# Altium schematic sheet Channel.SchDoc
size A3; SheetNumber: 2; SheetTotal: 4
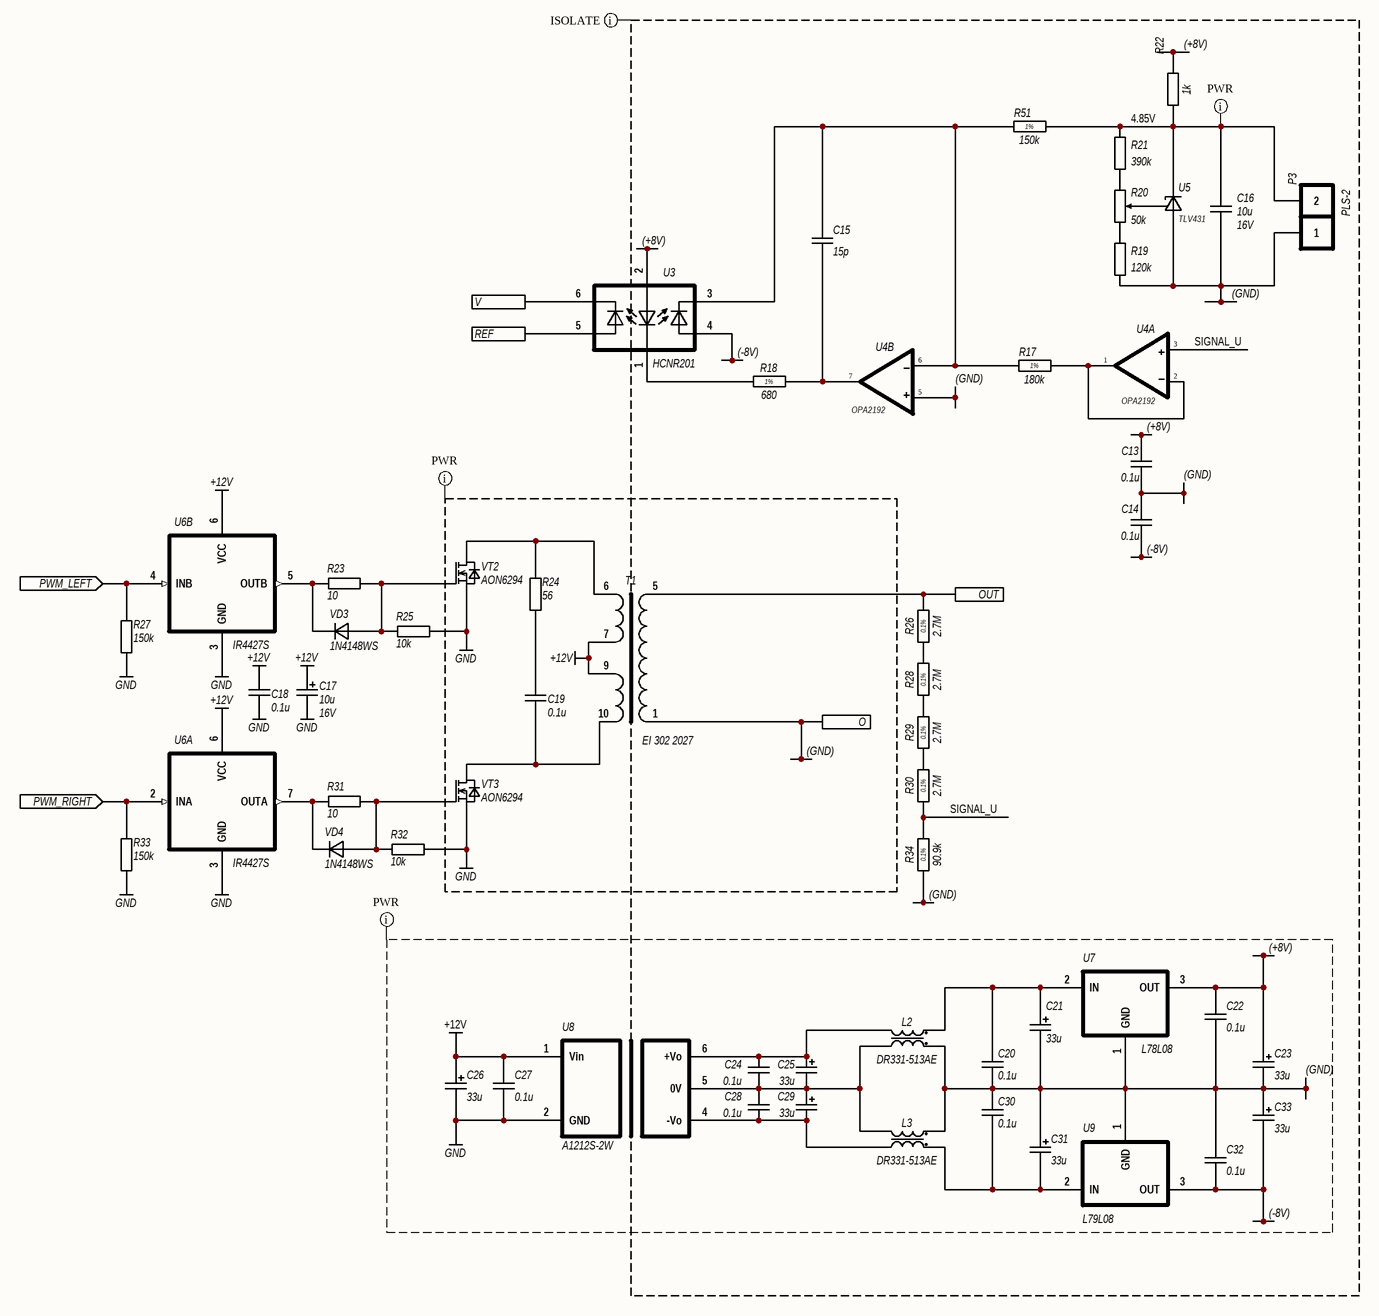
[diagram p0: Channel.SchDoc]

## Parts
C13  0.1u  [C0603(1608)]
C14  0.1u  [C0603(1608)]
C15  15p  [C0603(1608)]
C16  10u  Voltage: 16V  [C0603(1608)]
C17  10u  Voltage: 16V  [EL Case A (3216-18)]
C18  0.1u  [C0603(1608)]
C19  0.1u  [C1206(3216)]
C20  0.1u  [C0603(1608)]
C21  33u  [EL Case A (3216-18)]
C22  0.1u  [C0603(1608)]
C23  33u  [EL Case A (3216-18)]
C24  0.1u  [C0603(1608)]
C25  33u  [EL Case A (3216-18)]
C26  33u  [EL Case A (3216-18)]
C27  0.1u  [C0603(1608)]
C28  0.1u  [C0603(1608)]
C29  33u  [EL Case A (3216-18)]
C30  0.1u  [C0603(1608)]
C31  33u  [EL Case A (3216-18)]
C32  0.1u  [C0603(1608)]
C33  33u  [EL Case A (3216-18)]
L2  DR331-513AE  [DR331]
L3  DR331-513AE  [DR331]
P3  PLS-2  [PLS-2]
R17  180k  Accuracy: 1%  [R0603]
R18  680  Accuracy: 1%  [R1206]
R19  120k  [R0603]
R20  50k  [T910W (3296W)]
R21  390k  [R0603]
R22  1k  [R0603]
R23  10  [R0603]
R24  56  [R2512]
R25  10k  [R0603]
R26  2.7M  Accuracy: 0.1%  [R2512]
R27  150k  [R0603]
R28  2.7M  Accuracy: 0.1%  [R2512]
R29  2.7M  Accuracy: 0.1%  [R2512]
R30  2.7M  Accuracy: 0.1%  [R2512]
R31  10  [R0603]
R32  10k  [R0603]
R33  150k  [R0603]
R34  90.9k  Accuracy: 0.1%  [R2512]
R51  150k  Accuracy: 1%  [R0603]
T1  EI 302 2027  [EI 302 2027]
U3  HCNR201  [HCNR201]
U4  OPA2192  [SO8-150]  (parts A,B of 2)
U5  TLV431  [SOT23]
U6  IR4427S  [SO8-150]  (parts A,B of 2)
U7  L78L08  [SO8-150]
U8  A1212S-2W  [AxxyyS-2W]
U9  L79L08  [SO8-150]
VD3  1N4148WS  [SOD323]
VD4  1N4148WS  [SOD323]
VT2  AON6294  [DFN5x6]
VT3  AON6294  [DFN5x6]

## Ports
O (see Main[8A]), OUT (see Main[8A]), PWM_LEFT (in, see Main[7A]), PWM_RIGHT (in, see Main[7A]), REF (see Main[7A]), V (see Main[7A])

## Nets
+12V: C17.1 C18.1 C26.1 C27.2 T1.7 T1.9 U6.6(VCC) U8.1(Vin)
GND: C17.2 C18.2 C26.2 C27.1 R25.1 R27.2 R32.1 R33.2 U6.3(GND) U8.2(GND) VT2.3(S) VT3.3(S)
V+: U4.8(V+)
V-: U4.4(V-)
(+8V): C13.2 C22.2 C23.1 R22.1 U3.2(LED_ANODE) U7.3(OUT)
(-8V): C14.1 C32.1 C33.2 U3.4(PD1_ANODE) U9.3(OUT)
(GND): C13.1 C14.2 C16.1 C20.1 C21.2 C22.1 C23.2 C30.2 C31.1 C32.2 C33.1 L2.1 L3.2 P3.1 R19.2 R34.1 T1.1 U4.5(+IN) U5.3(A) U7.1(GND) U9.1(GND) ; port O
OUT: R26.2 T1.5 ; port OUT
PWM_LEFT: R27.1 U6.4(INB) ; port PWM_LEFT
PWM_RIGHT: R33.1 U6.2(INA) ; port PWM_RIGHT
REF: U3.5(PD2_ANODE) ; port REF
SIGNAL_U: R30.1 R34.2 U4.3(+IN)
V: U3.6(PD2_CATHODE) ; port V
NetC15_1: C15.1 R18.1 U4.7(OUT)
NetC15_2: C15.2 R17.2 R51.2 U3.3(PD1_CATHODE) U4.6(-IN)
NetC16_2: C16.2 P3.2 R21.1 R22.2 R51.1 U5.2(K)
NetC19_1: C19.1 R24.1
NetC19_2: C19.2 T1.10 VT3.2(D)
NetC20_2: C20.2 C21.1 L2.2 U7.2(IN)
NetC24_1: C24.1 C25.2 C28.2 C29.1 L2.4 L3.3 U8.5(0V)
NetC24_2: C24.2 C25.1 L2.3 U8.6(+Vo)
NetC28_1: C28.1 C29.2 L3.4 U8.4(-Vo)
NetC30_1: C30.1 C31.2 L3.1 U9.2(IN)
NetR17_1: R17.1 U4.1(OUT) U4.2(-IN)
NetR18_2: R18.2 U3.1(LED_CATHODE)
NetR19_1: R19.1 R20.1
NetR20_2: R20.2 U5.1(Adj)
NetR20_3: R20.3 R21.2
NetR23_1: R23.1 U6.5(OUTB) VD3.2(K)
NetR23_2: R23.2 R25.2 VD3.1(A) VT2.1(G)
NetR24_2: R24.2 T1.6 VT2.2(D)
NetR26_1: R26.1 R28.2
NetR28_1: R28.1 R29.2
NetR29_1: R29.1 R30.2
NetR31_1: R31.1 U6.7(OUTA) VD4.2(K)
NetR31_2: R31.2 R32.2 VD4.1(A) VT3.1(G)

## Layout directives
net class PWR: (+8V), (-8V), (GND), +12V, GND, NetC16_2
mark named ISOLATE: (+8V), (-8V), (GND), SIGNAL_U

## Notes on the sheet
- 4.85V
- Автор
- Дата

## Library data of the parts
C13-C16 C20 C22 C24 C27 C28 C30 C32 = Capasitor SMD: Model: *
  C13 C14 C20 C22 C24 C27 C28 C30 C32: Value: 0.1u
  C15: Value: 15p
  C16: Value: 10u
C17 = Capasitor TECAP: 10uF 16V Tantalum capasitor in Case-A; Value: 10u
C18 C19 = Capasitor SMD: Multilayer Ceramic Capacitors MLCC - SMD/SMT; Value: 0.1u
C21 C23 C25 C26 C29 C31 C33 = Capasitor TECAP: Model: 293D107X9010D2TE3; Voltage: 6.3V; Value: 33u
L2 L3 = Chocke Inductor: Model: DR331-513AE
R17-R19 R21 R22 R26 R28-R30 R34 R51 = Resistor SMD: Model: *
  R17: Value: 180k
  R18: Value: 680
  R19: Value: 120k; Accuracy: *
  R21: Value: 390k; Accuracy: *
  R22: Value: 1k; Accuracy: *
  R26 R28-R30: Value: 2.7M
  R34: Value: 90.9k
  R51: Value: 150k
R20 = Trimming Resistor: Set Position: 0.5; Value: 50k
R23-R25 R27 R31-R33 = Resistor SMD: Thick Film Resistors - SMD; Model: *
  R23 R31: Value: 10
  R24: Value: 56
  R25 R32: Value: 10k
  R27 R33: Value: 150k
T1 = EI 30
U4 = OPA2192: 36-V, Precision, RRIO, Low Offset Voltage, e-trim Op Amp, 5uV 10MHz 20V/us 1mA
U5 = TLV431: Low Voltage Precision Low noise Variable "Zener". Vin up to 7V, 0.25Ohm output impedance. Sink-current 0.05 - 3mA. Reference voltage - 1.24V
U6 = IR4427S: Dual Low Side Driver
U7 = L78Lxx: pin to pad: 1>2+3+6+7 2>8 3>1
U8 = AxxyyS-1W: In: 12; Power: 2; Out: 12
U9 = L79Lxx: pin to pad: 1>5 2>2+3+6+7 3>1
VD3 VD4 = 1N4148WS: SOD323 100V 200mA
VT2 VT3 = AON6294: N-MOS 100V 10(14)mΩ 33(52)A